# Altium project STM32RF.PrjPcb
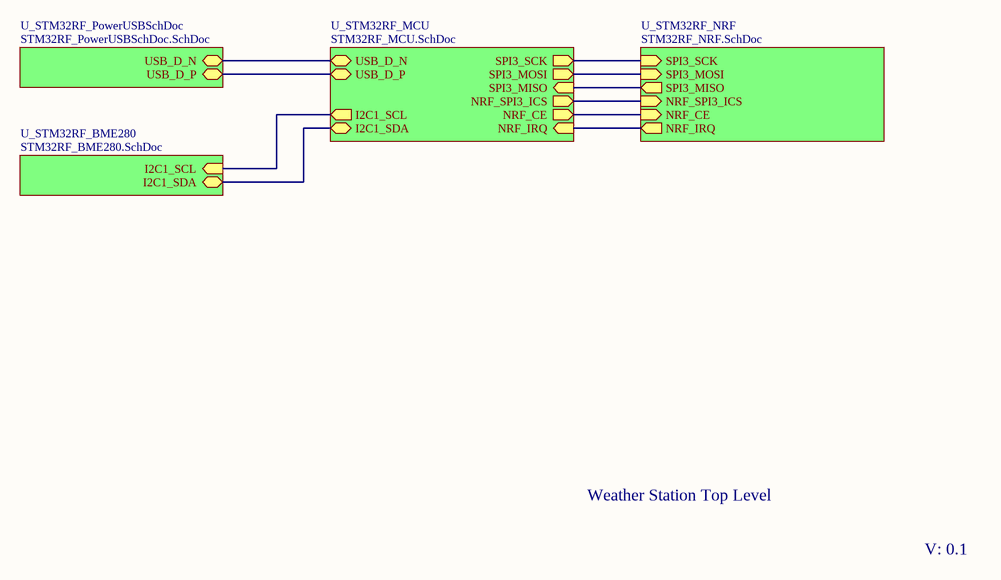
[diagram p0: STM32RF_TopLevel.SchDoc]
5 sheets, 72 parts. Net scope: hierarchical (ports join the sheet entries above them; power ports are global).
Board file: STM32RF_PCB.PcbDoc
Sheets:
  STM32RF_TopLevel.SchDoc
    U_STM32RF_MCU = STM32RF_MCU.SchDoc
    U_STM32RF_NRF = STM32RF_NRF.SchDoc
    U_STM32RF_BME280 = STM32RF_BME280.SchDoc
    U_STM32RF_PowerUSBSchDoc = STM32RF_PowerUSBSchDoc.SchDoc

## Sheet STM32RF_TopLevel.SchDoc
size A; SheetNumber: 1; SheetTotal: 5

### Sub-sheets
U_STM32RF_BME280 = STM32RF_BME280.SchDoc: I2C1_SCL (in), I2C1_SDA (bidir)
U_STM32RF_MCU = STM32RF_MCU.SchDoc: I2C1_SCL (out), I2C1_SDA (bidir), USB_D_N (bidir), USB_D_P (bidir), NRF_IRQ (in), SPI3_SCK (out), SPI3_MISO (in), SPI3_MOSI (out), NRF_SPI3_ICS (out), NRF_CE (out)
U_STM32RF_NRF = STM32RF_NRF.SchDoc: NRF_CE (in), NRF_SPI3_ICS (in), SPI3_MISO (out), SPI3_MOSI (in), SPI3_SCK (in), NRF_IRQ (out)
U_STM32RF_PowerUSBSchDoc = STM32RF_PowerUSBSchDoc.SchDoc: USB_D_N (bidir), USB_D_P (bidir)

### Nets
I2C1_SCL: sheet U_STM32RF_MCU/I2C1_SCL, sheet U_STM32RF_BME280/I2C1_SCL
I2C1_SDA: sheet U_STM32RF_MCU/I2C1_SDA, sheet U_STM32RF_BME280/I2C1_SDA
NRF_CE: sheet U_STM32RF_MCU/NRF_CE, sheet U_STM32RF_NRF/NRF_CE
NRF_IRQ: sheet U_STM32RF_MCU/NRF_IRQ, sheet U_STM32RF_NRF/NRF_IRQ
NRF_SPI3_ICS: sheet U_STM32RF_MCU/NRF_SPI3_ICS, sheet U_STM32RF_NRF/NRF_SPI3_ICS
SPI3_MISO: sheet U_STM32RF_MCU/SPI3_MISO, sheet U_STM32RF_NRF/SPI3_MISO
SPI3_MOSI: sheet U_STM32RF_MCU/SPI3_MOSI, sheet U_STM32RF_NRF/SPI3_MOSI
SPI3_SCK: sheet U_STM32RF_MCU/SPI3_SCK, sheet U_STM32RF_NRF/SPI3_SCK
USB_D_N: sheet U_STM32RF_MCU/USB_D_N, sheet U_STM32RF_PowerUSBSchDoc/USB_D_N
USB_D_P: sheet U_STM32RF_MCU/USB_D_P, sheet U_STM32RF_PowerUSBSchDoc/USB_D_P

### Notes on the sheet
- Weather Station Top Level
- V: 0.1

## Sheet STM32RF_MCU.SchDoc
size A4; SheetNumber: 2; SheetTotal: 5
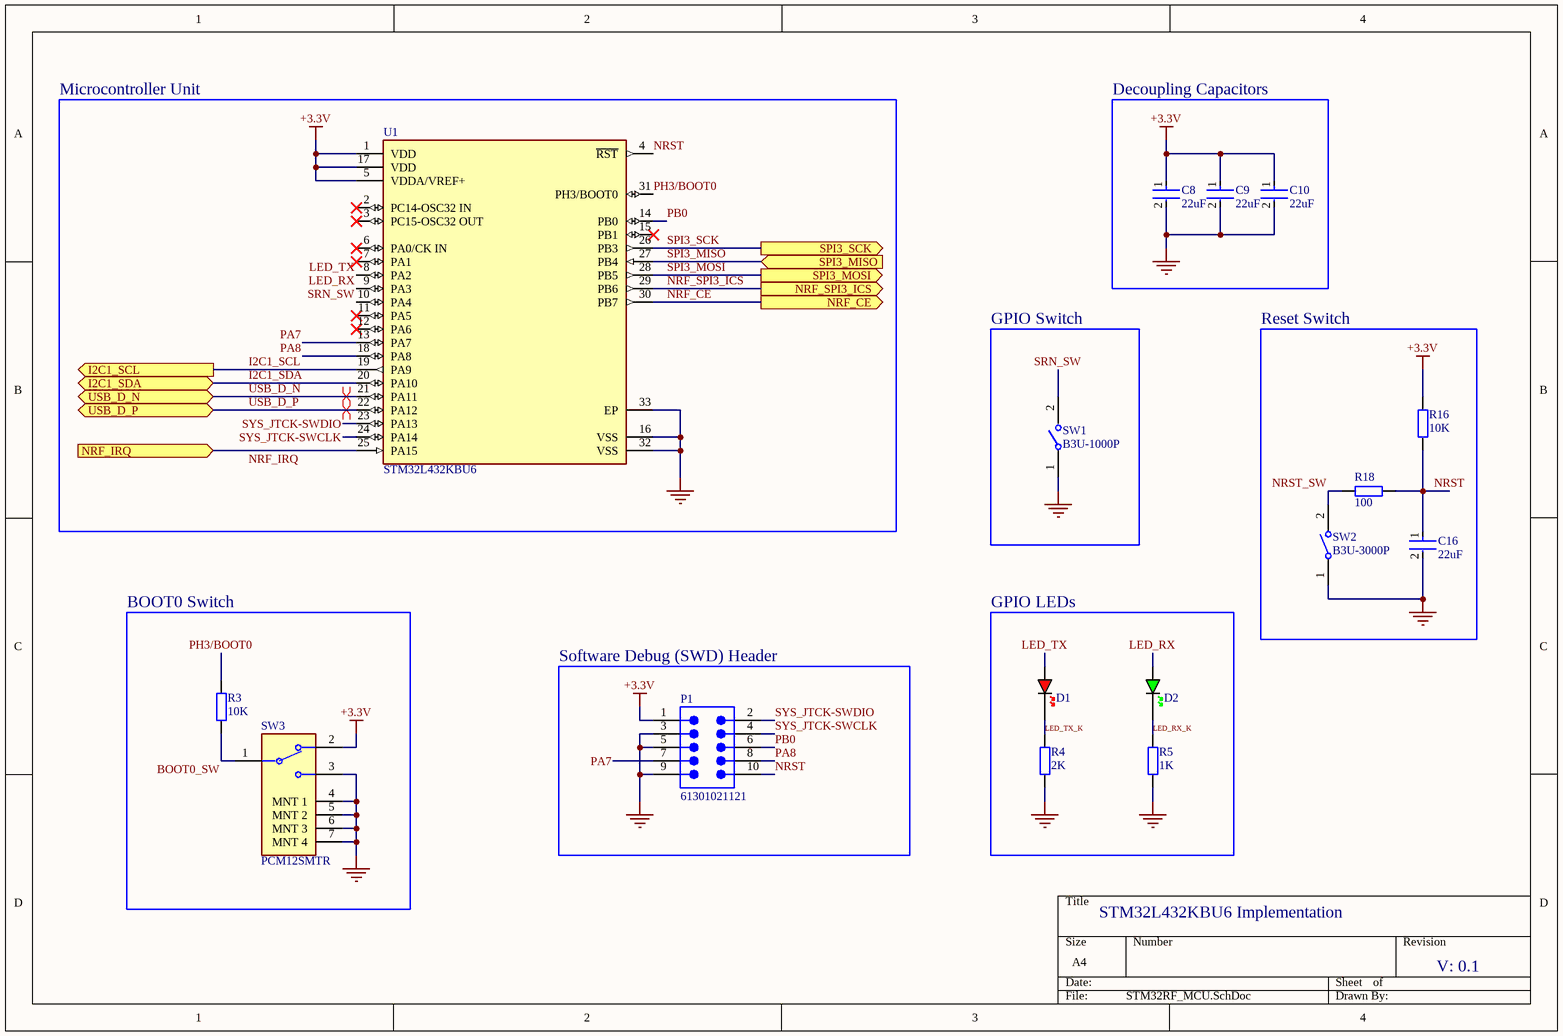
[diagram p1: STM32RF_MCU.SchDoc]

### Parts
C8  22uF  [FP-GRM158-0_2-MFG]
C9  22uF  [FP-GRM158-0_2-MFG]
C10  22uF  [FP-GRM158-0_2-MFG]
C16  22uF  [FP-GRM158-0_2-MFG]
D1  RED  [LED_0402_RED]  (value not drawn)
D2  GREEN  [LED_0402_GREEN]  (value not drawn)
P1  61301021121  [61301021121]
R3  10K  [RES_0402]
R4  2K  [RES_0402]
R5  1K  [RES_0402]
R16  10K  [RES_0402]
R18  100  [RES_0402]
SW1  B3U-1000P  [FP-B3U-1000P-MFG]
SW2  B3U-3000P  [OMRON-B3U-3000P_V]
SW3  PCM12SMTR  [FP-PCM12SMTR-MFG]
U1  STM32L432KBU6  [FP-UFQFPN32-A0B8-MFG]

### Blocks framed on the sheet
Microcontroller Unit: U1
Decoupling Capacitors: C8-C10
GPIO Switch: SW1
Reset Switch: C16 R16 R18 SW2
BOOT0 Switch: R3 SW3
GPIO LEDs: D1 D2 R4 R5
Software Debug (SWD) Header: P1

### Ports
I2C1_SCL (out, see STM32RF_TopLevel[2C], STM32RF_BME280[2C]), I2C1_SDA (bidir, see STM32RF_TopLevel[2C], STM32RF_BME280[2C]), NRF_CE (out, see STM32RF_TopLevel[3C], STM32RF_NRF[1A]), NRF_IRQ (in, see STM32RF_TopLevel[3C], STM32RF_NRF[2A]), NRF_SPI3_ICS (out, see STM32RF_TopLevel[3B], STM32RF_NRF[1A]), SPI3_MISO (in, see STM32RF_TopLevel[3B], STM32RF_NRF[1A]), SPI3_MOSI (out, see STM32RF_TopLevel[3B], STM32RF_NRF[1A]), SPI3_SCK (out, see STM32RF_TopLevel[3B], STM32RF_NRF[1A]), USB_D_N (bidir, see STM32RF_TopLevel[2B], STM32RF_PowerUSBSchDoc[2A]), USB_D_P (bidir, see STM32RF_TopLevel[2B], STM32RF_PowerUSBSchDoc[2A])

### Nets
+3.3V: C8.1 C9.1 C10.1 P1.1 R16.2 SW3.2 U1.1(VDD) U1.5(VDDA/VREF+) U1.17(VDD)
GND: C8.2 C9.2 C10.2 C16.2 P1.3 P1.5 P1.9 R4.1 R5.1 SW1.1 SW2.1 SW3.3 SW3.4(MNT_1) SW3.5(MNT_2) SW3.6(MNT_3) SW3.7(MNT_4) U1.16(VSS) U1.32(VSS) U1.33(EP)
BOOT0_SW: R3.1 SW3.1
I2C1_SCL: U1.19(PA9) ; port I2C1_SCL
I2C1_SDA: U1.20(PA10) ; port I2C1_SDA
LED_RX: D2.A U1.9(PA3)
LED_RX_K: D2.K R5.2
LED_TX: D1.A U1.8(PA2)
LED_TX_K: D1.K R4.2
NRF_CE: U1.30(PB7) ; port NRF_CE
NRF_IRQ: U1.25(PA15) ; port NRF_IRQ
NRF_SPI3_ICS: U1.29(PB6) ; port NRF_SPI3_ICS
NRST: C16.1 P1.10 R16.1 R18.1 U1.4(~{RST})
NRST_SW: R18.2 SW2.2
PA7: P1.7 U1.13(PA7)
PA8: P1.8 U1.18(PA8)
PB0: P1.6 U1.14(PB0)
PH3/BOOT0: R3.2 U1.31(PH3/BOOT0)
SPI3_MISO: U1.27(PB4) ; port SPI3_MISO
SPI3_MOSI: U1.28(PB5) ; port SPI3_MOSI
SPI3_SCK: U1.26(PB3) ; port SPI3_SCK
SRN_SW: SW1.2 U1.10(PA4)
SYS_JTCK-SWCLK: P1.4 U1.24(PA14)
SYS_JTCK-SWDIO: P1.2 U1.23(PA13)
USB_D_N: U1.21(PA11) ; port USB_D_N
USB_D_P: U1.22(PA12) ; port USB_D_P

Not connected (* = marked no-connect by the designer): U1 2(PC14-OSC32_IN)* 3(PC15-OSC32_OUT)* 6(PA0/CK_IN)* 7(PA1)* 11(PA5)* 12(PA6)* 15(PB1)*

### Layout directives
differential pair: USB_D_N, USB_D_P

### Notes on the sheet
- STM32L432KBU6 Implementation
- V: 0.1

### Library data of the parts
C8-C10 C16 = CMP-06035-020400-1: Chip Multilayer Ceramic Capacitors for General Purpose, 0402, 22uF, X5R, 15%, 20%, 10V
D1 = LED_0402_RED: LED 0402 RED SMD
D2 = LED_0402_GREEN: LED 0402 GREEN SMD
P1 = CMP-1502-01084-4: THT Vertical Pin Header WR-PHD, Pitch 2.54 mm, Dual Row, 10 pins; Insulation Resistance: 1GΩ; Connector Type: Male Pin; Number of Contacts: 10; Pitch: 2.54mm; Contact Resistance: 20mΩ; Current Rating: 3A; Gender: Male; Insulation: Insulated; Voltage Rating: 250V; Mount: Through Hole; Orientation: Vertical; Max Operating Temperature: 105°C; Height: 8.89mm; Number of Pins: 10; Housing Material: PBT; Number of Positions: 10; Packaging: Bulk; RoHS: Compliant; Contact Mating Length: 5.9944mm; Lead Pitch: 2.54mm; Contact Gender: Male; Flammability Rating: UL94 V-0; Color: Black; Termination: Through Hole; Width: 12.7mm; Number of Rows: 2; Contact Material: Gold; Contact Plating: Gold; Operating Supply Voltage: 250V; Length: 12.7mm; Min Operating Temperature: -40°C; Row Spacing: 2.54mm
R3-R5 R16 R18 = RES_0402: Resistor SMD 0402; Manufacturer: *; Manufacturer Part Number: *; Distributor Link: *; LCSC: *
SW1 = CMP-2100-03586-2: SWITCH TACTILE SPST-NO 0.05A 12V; Contact Resistance: 100mR; Operating Force: 1.5N; Max Current Rating: 50mA; Switch Travel: 0.15mm; Actuator Type: Standard; Mechanical Life: 200000Cycles; Ratings: Dust Proof; Illumination Type: Non-Illuminated; Throw Configuration: SPST; Actuator Length: 0.4mm; Switch Function: Off-Mom; Height: 1.2mm; Width: 3mm; Weight: 0.000776oz; Contact Material: Silver; Max Voltage Rating (DC): 12V; Insulation Resistance: 100MR; Lead Free: Lead Free; Current Rating: 50mA; Termination: SMD/SMT; Length: 4mm; Voltage Rating (DC): 12V; Contact Current Rating: 50mA; Orientation: Straight; Depth: 2.5mm; Max Operating Temperature: 70°C; Packaging: Tape and Reel; Min Operating Temperature: -25°C; Package Quantity: 1; Mount: Surface Mount; Electrical Life: 200000Cycles
SW2 = CMP-1677-00003-1: Ultra-Small Tactile Switch, 1 to 50 mA, 3 to 12 V, -25 to 70 degC, 2-Pin SMD, RoHS, Tape and Reel; Tolerance: 20%; Voltage Rating (DC): 50 V; Capacitance: 470 uF; Case\Package: Radial; PackageReference: B3U-3000P; Min Operating Temperature: -40 degC; Length: 20 mm; Mount: Through Hole; ComponentLink2Description: Datasheet; RoHSCompliant: true; ComponentLink1URL: http://www.omron.com/; Package Quantity: 200; Radiation Hardening: No; Height: 20 mm; ComponentLink2URL: https://www.omron.com/ecb/products/pdf/en-b3u.pdf; Diameter: 10 mm; Max Operating Temperature: 85 degC; Lead Pitch: 5 mm; DatasheetVersion: Jan-15; Packaging: Bulk; PackageDescription: 2-Pin Surface Mount Device, Body 4 x 3.2 mm; Voltage Rating: 50 V; Pins: 2; ComponentLink1Description: Manufacturer URL; REACH SVHC: No SVHC
SW3 = CMP-2000-06884-2: SWITCH SLIDE SPDT 300MA 6V; Actuator Material: Nylon; Switch Function: On-On; Insulation Resistance: 100mR; Actuator Type: Standard; Mechanical Life: 10000Cycles; Actuator Length: 1.5mm; Contact Resistance: 70mR; Min Operating Temperature: -20°C; Max Current Rating: 300mA; Max Voltage Rating (DC): 6V; Package Quantity: 1; Mount: Surface Mount; Packaging: Tape and Reel; Contact Plating: Silver; Depth: 5mm; REACH SVHC: No SVHC; Voltage Rating (DC): 6V; Voltage Rating (AC): 6V; Max Operating Temperature: 85°C; Length: 7.7mm; Termination: Gull Wing; Current Rating: 300mA; Contact Current Rating: 300mA; Orientation: Right Angle; Width: 6.7mm; Switch Travel: 1.5mm; Lead Free: Lead Free; Contact Material: Copper Alloy; Throw Configuration: SPDT
U1 = CMP-12105-000014-1: IC MCU 32BIT 128KB FLASH 32QFPN; Manufacturer: STMicroelectronics; Memory Size: 128KBytes; Number Of I/Os: 26; Max Supply Voltage: 3.6V; Core Architecture: ARM Cortex-M4; Number Of A/D Converters: 1; Number Of Timers/Counters: 8; Min Supply Voltage: 1.62V; Interface: I2C,SPI,UART,USART,USB,IrDA; Number Of Spi Channels: 2; Frequency: 80MHz; Max Junction Temp: +105°C; Number Of Adc Channels: 10; Ram Size: 64KBytes; Data Bus Width: 32bits; Ambient Temperature Range High: +85°C; Device Class L2: Embedded Processors and Controllers; Temperature: -40°C to +85°C; Category: IC; ComponentLink2URL: https://www.st.com/resource/en/datasheet/stm32l432kb.pdf; Device Class L1: Integrated Circuits (ICs); ComponentLink2Description: Datasheet; Memory Type: FLASH; Ipc Land Pattern Name: QFN50P500X500X55-32; Temperature Range Low: -40°C; Height: 0.6mm; Digikey Description: IC MCU 32BIT 128KB FLASH 32QFPN; Temperature Range High: +85°C; Device Class L3: Microcontrollers; Lead Free: Yes; RoHS: TRUE; Octopart: https://octopart.com/stm32l432kbu6-stmicroelectronics-74568735; Manufacturer Part Number: STM32L432KBU6; Number Of Uart Channels: 1; Ambient Temperature Range Low: -40°C; Package: UFQFPN32-A0B8; Number Of I2C Channels: 2; Number Of Cores: 1; Automotive: No

## Sheet STM32RF_NRF.SchDoc
size A4; SheetNumber: 4; SheetTotal: 5
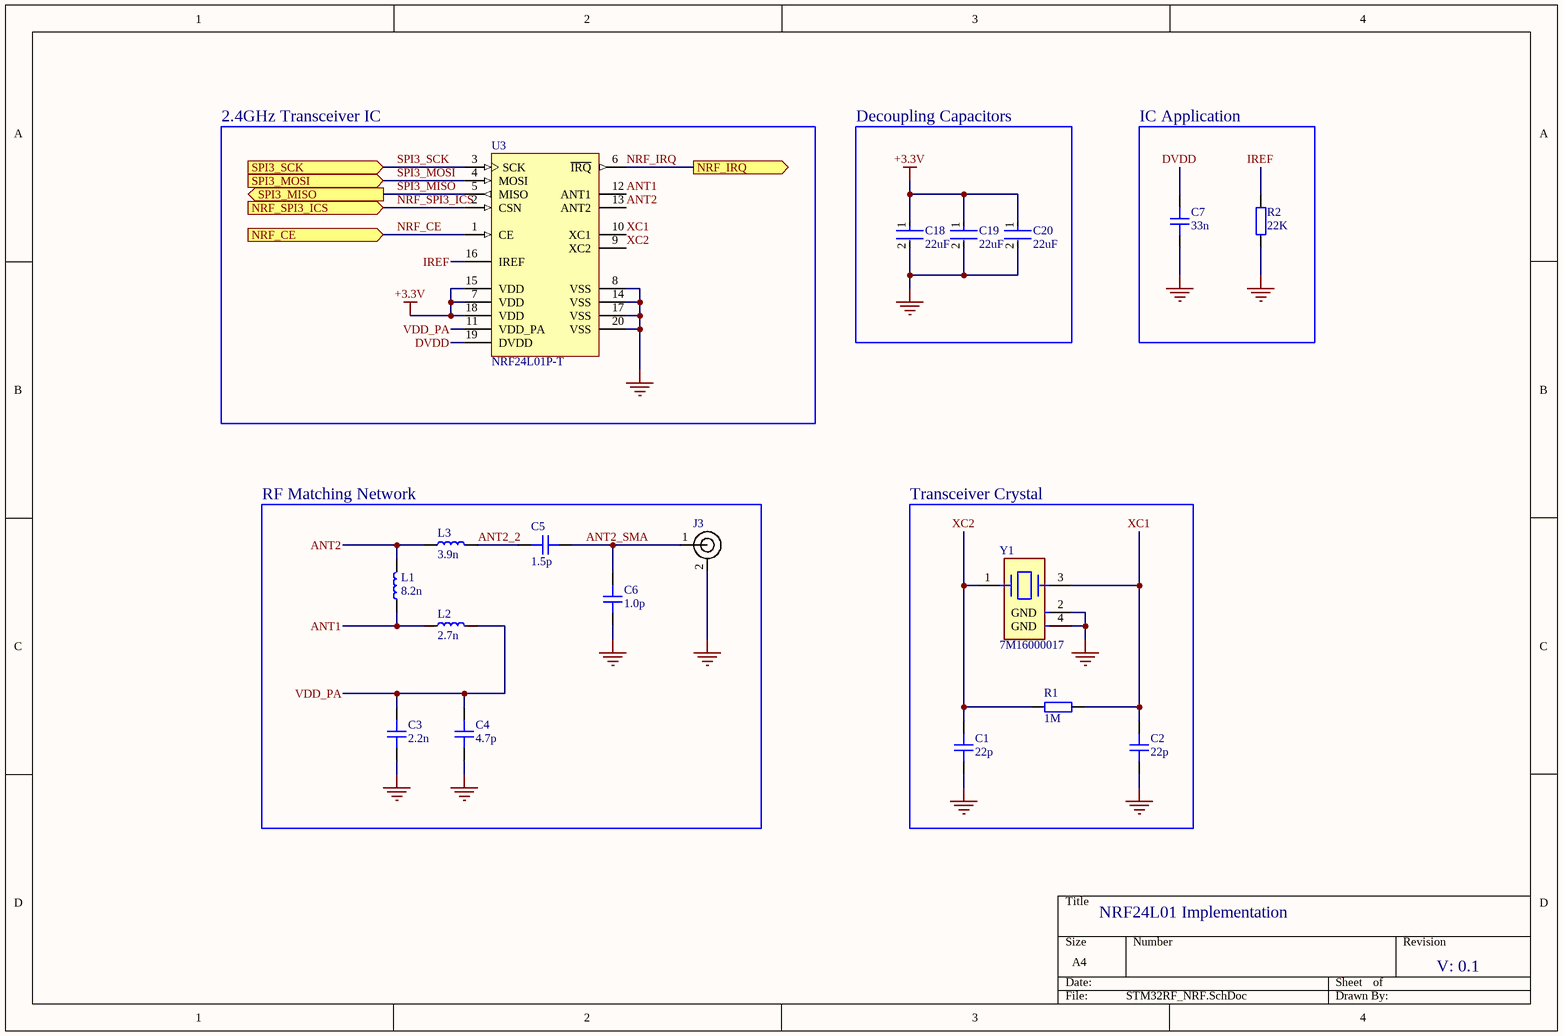
[diagram p2: STM32RF_NRF.SchDoc]

### Parts
C1  22p  [CAP_0402]
C2  22p  [CAP_0402]
C3  2.2n  [CAP_0402]
C4  4.7p  [CAP_0402]
C5  1.5p  [CAP_0402]
C6  1.0p  [CAP_0402]
C7  33n  [CAP_0402]
C18  22uF  [FP-GRM158-0_2-MFG]
C19  22uF  [FP-GRM158-0_2-MFG]
C20  22uF  [FP-GRM158-0_2-MFG]
J3  CON-SMA-EDGE-S  [CON-SMA-EDGE-S]  (value not drawn)
L1  8.2n  [IND_0402]
L2  2.7n  [IND_0402]
L3  3.9n  [IND_0402]
R1  1M  [RES_0402]
R2  22K  [RES_0402]
U3  NRF24L01P-T  [NRSC-QFN-20_L]
Y1  7M16000017  [FP-7M-MFG]

### Blocks framed on the sheet
2.4GHz Transceiver IC: U3
Decoupling Capacitors: C18-C20
IC Application: C7 R2
RF Matching Network: C3-C6 J3 L1-L3
Transceiver Crystal: C1 C2 R1 Y1

### Ports
NRF_CE (in, see STM32RF_TopLevel[3C], STM32RF_MCU[2B]), NRF_IRQ (out, see STM32RF_TopLevel[3C], STM32RF_MCU[1B]), NRF_SPI3_ICS (in, see STM32RF_TopLevel[3B], STM32RF_MCU[2B]), SPI3_MISO (out, see STM32RF_TopLevel[3B], STM32RF_MCU[2B]), SPI3_MOSI (in, see STM32RF_TopLevel[3B], STM32RF_MCU[2B]), SPI3_SCK (in, see STM32RF_TopLevel[3B], STM32RF_MCU[2A])

### Nets
+3.3V: C18.1 C19.1 C20.1 U3.7(VDD) U3.15(VDD) U3.18(VDD)
GND: C1.1 C2.1 C3.1 C4.1 C6.1 C7.1 C18.2 C19.2 C20.2 J3.2 R2.1 U3.8(VSS) U3.14(VSS) U3.17(VSS) U3.20(VSS) Y1.2(GND) Y1.4(GND)
ANT1: L1.1 L2.1 U3.12(ANT1)
ANT2: L1.2 L3.1 U3.13(ANT2)
ANT2_2: C5.2 L3.2
ANT2_SMA: C5.1 C6.2 J3.1
DVDD: C7.2 U3.19(DVDD)
IREF: R2.2 U3.16(IREF)
NRF_CE: U3.1(CE) ; port NRF_CE
NRF_IRQ: U3.6(~{IRQ}) ; port NRF_IRQ
NRF_SPI3_ICS: U3.2(CSN) ; port NRF_SPI3_ICS
SPI3_MISO: U3.5(MISO) ; port SPI3_MISO
SPI3_MOSI: U3.4(MOSI) ; port SPI3_MOSI
SPI3_SCK: U3.3(SCK) ; port SPI3_SCK
VDD_PA: C3.2 C4.2 L2.2 U3.11(VDD_PA)
XC1: C2.2 R1.2 U3.10(XC1) Y1.3
XC2: C1.2 R1.1 U3.9(XC2) Y1.1

### Notes on the sheet
- NRF24L01 Implementation
- V: 0.1

### Library data of the parts
C1-C7 = CAP_0402: Capacitor SMD 0402; Manufacturer: *; Manufacturer Part Number: *; Distributor Link: *; LCSC: *; Rating: *; Dielectric: *
C18-C20 = CMP-06035-020400-1: as C8 on sheet STM32RF_MCU
J3 = CON-SMA-EDGE-S: RF Connector SMA Female 50 Ohms 18 GHz PCB Edge Mount; Manufacturer: RF Solutions; Manufacturer Part Number: CON-SMA-EDGE-S
L1-L3 = IND_0402: Inductor SMD 0402
R1 R2 = RES_0402: Resistor SMD 0402; Manufacturer: *; Manufacturer Part Number: *; Distributor Link: *; LCSC: *
U3 = CMP-2000-06859-1: Single Chip Transceiver, 2.4 GHz, 60 mW, 1.9 to 3.6 V, -40 to 85 degC, 20-Pin QFN, RoHS, Tray; Manufacturer: Nordic Semiconductor; Data Rate (Max): 2Mbps; Current - Transmitting: 7mA~11.3mA; Power - Output: 0dBm; Other Names: 1490-1019; Online Catalog: nRF24L01+; Current - Receiving: 12.6mA~13.5mA; For Use With: 1490-1002-ND-KITEVALUATIONNRF24L01P1568-1295-ND-SPARKFUNTRANSCEIVERBREAKOUT-1568-1296-ND-SPARKFUNTRANSCEIVERBREAKOUT-1471-1410-ND-DEVBOARDNRFSCLICKNRF24L01P-MODULE-PCB-ND-KITEVALNRF24L01+PCBANTENNANRF24L01P-MODULE-SMA-ND-KITEVALNRF24L01+SMACONNNRF24L01P-UPGRADE-ND-UPGRADE2PCB/1SMANRF24L01103990038-ND-DEVDUINOSENSORNODEV1.3103990053-ND-DEVDUINOSENSORNODEV2(ATMEGA103990074-ND-DEVDUINOSENSORNODE106990026-ND-ENERGYMONITORSHIELDV2113990088-ND-WIRELESSGATESHIELD113990095-ND-DEVDUINOSENSORNODEV3(ATMEGA106030001-ND-ENERGYMONITORSHIELD1597-1361-ND-DEVDUINOSENSORNODEV2.2(ATMEG105990030-ND-RGBWSTRIPWIRELESSSHIELDV1.0; Frequency: 2.4GHz; Design Resources: DevelopmentToolSelector; RF Family/Standard: GeneralISM>1GHZ; Serial Interfaces: SPI; Sensitivity: -94dBm; Voltage - Supply: 1.9V~3.6V; Modulation: GFSK; GPIO: -; Package Reference: QFN20; Memory Size: -; Category: RF/IFandRFID; Type: TxRxOnly; Standard Package: 490; Package / Case: 20-VFQFNExposedPad; Packaging: Tray; Series: -; Package Description: 20-Pin Quad Flat No-lead Package, Body 4 x 4 mm, Pitch 0.5 mm; Datasheet Version: Rev. 1.0, 09/2008; Protocol: -; Manufacturer URL: http://www.nordicsemi.com/eng/Products/; Operating Temperature: -40°C~85°C; Family: RFTransceiverICs; Datasheet URL: http://www.nordicsemi.com/eng/content/download/2726/34069/file/nRF24L01P_Product_Specification_1_0.pdf; Mounting Technology: SurfaceMount
Y1 = CMP-18717-000287-1: Crystal 16MHz, 10ppm, 9pF, 60Ω; ESR (Equivalent Series Resistance): 50R; Packaging: Tape and Reel; Frequency: 16MHz; Min Operating Temperature: -20°C; Length: 0.126inch; Height: 0.031inch; Frequency Stability: 10ppm; Frequency Tolerance: 10ppm; Max Operating Temperature: 75°C; Case/Package: SMD/SMT; Load Capacitance: 9pF; Mount: Surface Mount; Width: 0.098inch

## Sheet STM32RF_BME280.SchDoc
size A4; SheetNumber: 5; SheetTotal: 5
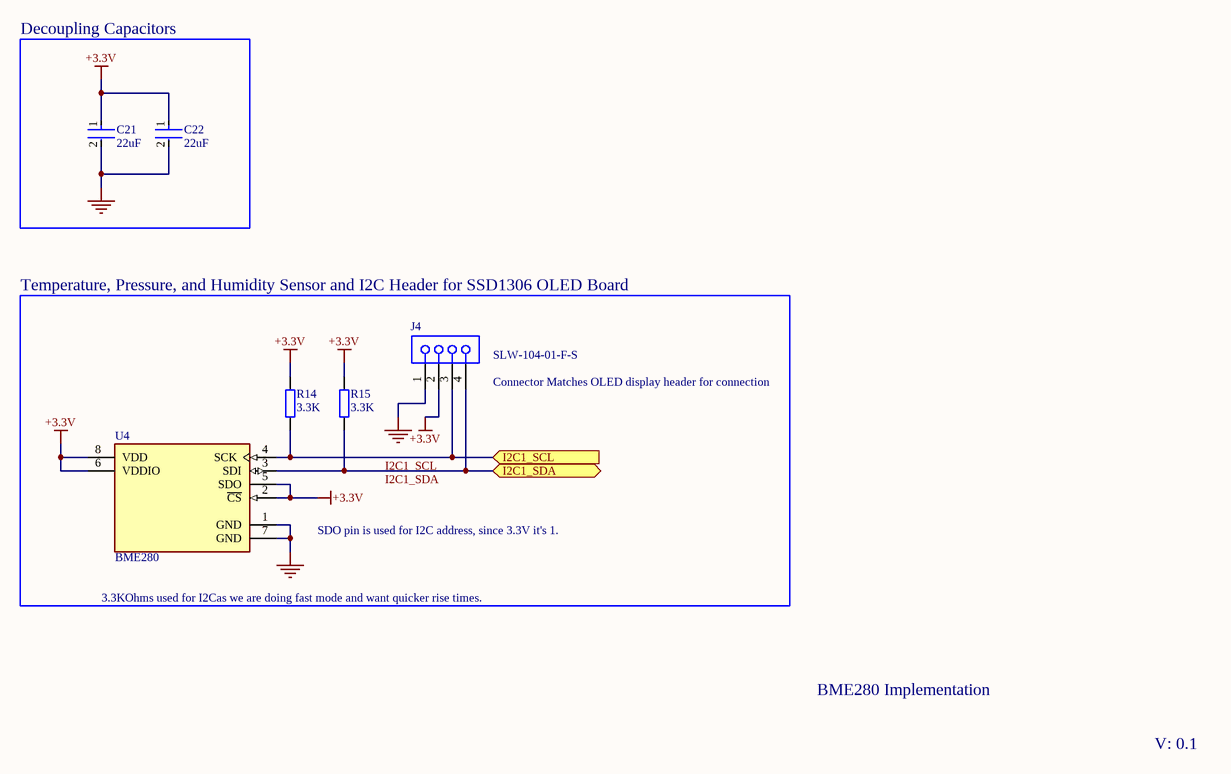
[diagram p3: STM32RF_BME280.SchDoc]

### Parts
C21  22uF  [FP-GRM158-0_2-MFG]
C22  22uF  [FP-GRM158-0_2-MFG]
J4  SLW-104-01-F-S  [SMTC-SLW-104-01-X-S]
R14  3.3K  [RES_0402]
R15  3.3K  [RES_0402]
U4  BME280  [FP-BME280-MFG]

### Blocks framed on the sheet
Decoupling Capacitors: C21 C22

### Ports
I2C1_SCL (in, see STM32RF_TopLevel[2C], STM32RF_MCU[1B]), I2C1_SDA (bidir, see STM32RF_TopLevel[2C], STM32RF_MCU[1B])

### Nets
+3.3V: C21.1 C22.1 J4.2 R14.2 R15.2 U4.2(~{CS}) U4.5(SDO) U4.6(VDDIO) U4.8(VDD)
GND: C21.2 C22.2 J4.1 U4.1(GND) U4.7(GND)
I2C1_SCL: J4.3 R14.1 U4.4(SCK) ; port I2C1_SCL
I2C1_SDA: J4.4 R15.1 U4.3(SDI) ; port I2C1_SDA

### Notes on the sheet
- Temperature, Pressure, and Humidity Sensor and I2C Header for SSD1306 OLED Board
- (near J4) Connector Matches OLED display header for connection
- SDO pin is used for I2C address, since 3.3V it's 1.
- 3.3KOhms used for I2Cas we are doing fast mode and want quicker rise times.
- BME280 Implementation
- V: 0.1

### Library data of the parts
C21 C22 = CMP-06035-020400-1: as C8 on sheet STM32RF_MCU
J4 = CMP-1023-00132-1: Low Profile Socket Strips, Through-hole, Vertical, -55 to 125 degC, 2.54 mm Pitch, 4-Pin, Female, RoHS; Manufacturer: Samtec; Pitch: 2.54 mm; PackageVersion: X, 9/1987; ComponentLink2Description: Datasheet; PackageDescription: Low Profile Socket Strip; ComponentLink1URL: http://www.samtec.com; Orientation: Vertical; ComponentLink3URL: http://www.samtec.com/documents/webfiles/cpdf/SLW-1XX-01-X-X-MKT.pdf; ComponentLink1Description: Manufacturer URL; ComponentLink2URL: http://www.samtec.com/documents/webfiles/pdf/SLW.PDF; PackageReference: SLW-104-01-X-S; Mounting Technology: Through-hole; PartNumber: SLW-104-01-F-S; Temperature Range: -55 to 125 degC; DatasheetVersion: F-214; ComponentLink3Description: Package Specification; RoHS: True
R14 R15 = RES_0402: Resistor SMD 0402; Manufacturer: *; Manufacturer Part Number: *; Distributor Link: *; LCSC: *
U4 = CMP-2000-05073-3: SENSOR PRESSURE HUMIDITY TEMP; Sensor Type: Temperature; Accuracy: 3%; Response Time: 1s; Output Type: SPI; Min Operating Temperature: -40°C; Max Operating Temperature: 85°C; Case/Package: LGA; Packaging: Cut Tape; Mount: Surface Mount; Lead Free: Lead Free; Number of Pins: 8

## Sheet STM32RF_PowerUSBSchDoc.SchDoc
size A4; SheetNumber: 3; SheetTotal: 5
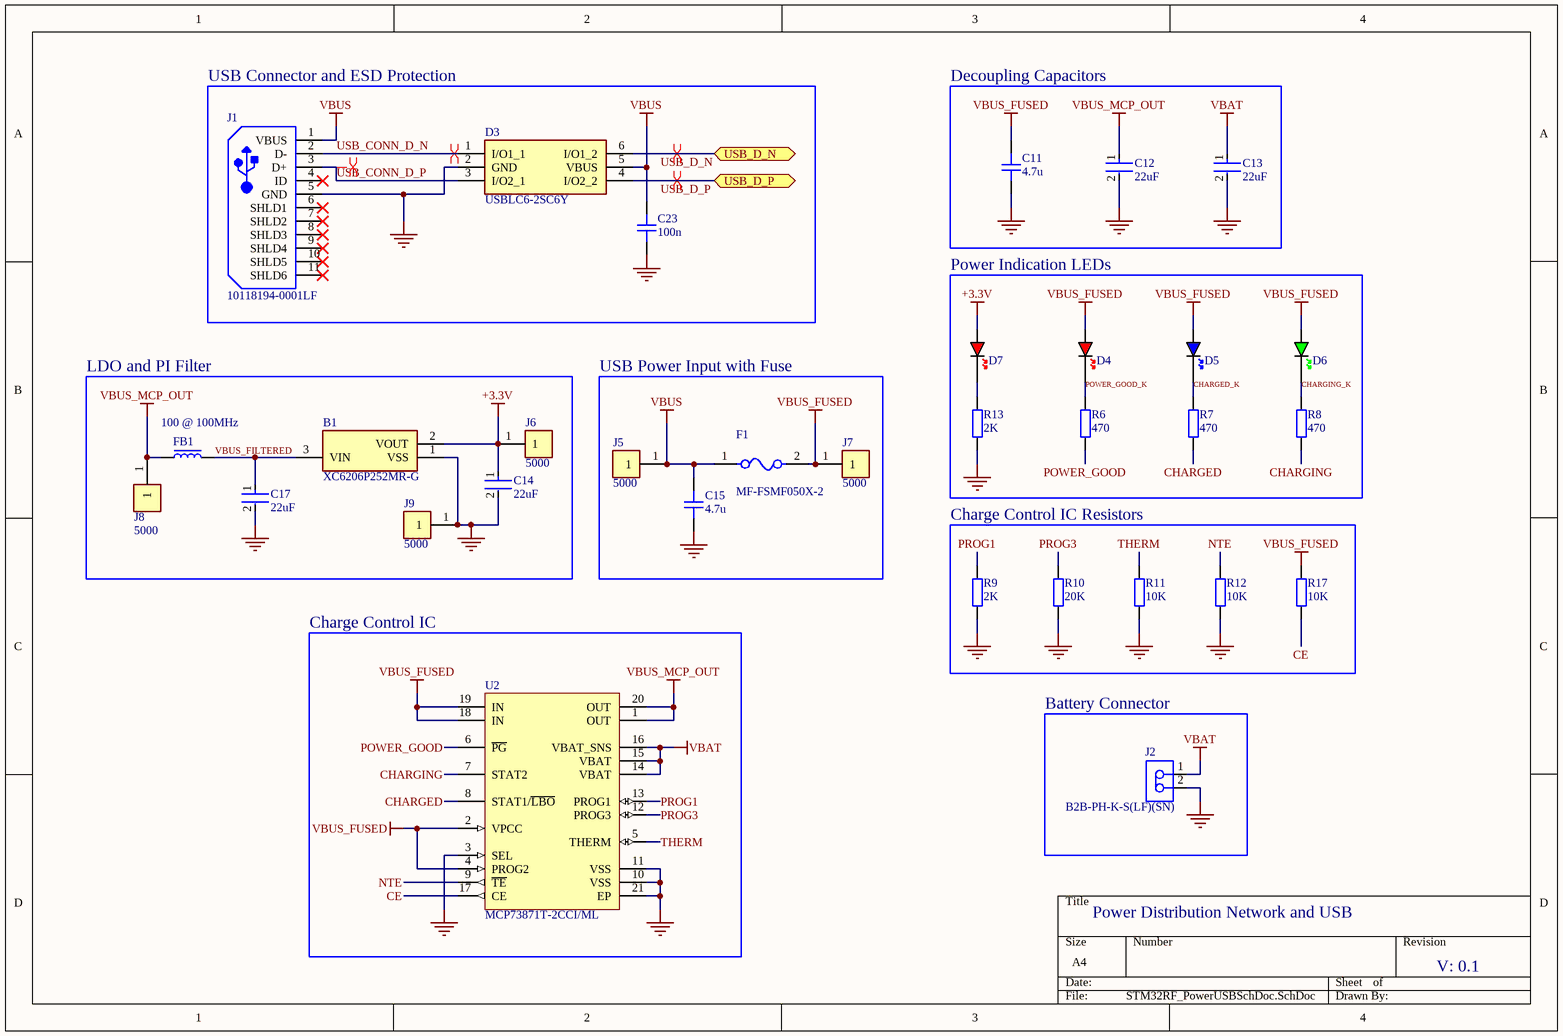
[diagram p4: STM32RF_PowerUSBSchDoc.SchDoc]

### Parts
B1  XC6206P252MR-G  [SOT95P280X130-3N]
C11  4.7u  [CAP_0402]
C12  22uF  [FP-GRM158-0_2-MFG]
C13  22uF  [FP-GRM158-0_2-MFG]
C14  22uF  [FP-GRM158-0_2-MFG]
C15  4.7u  [CAP_0402]
C17  22uF  [FP-GRM158-0_2-MFG]
C23  100n  [CAP_0402]
D3  USBLC6-2SC6Y  [SOT95P280X145-6N]
D4  RED  [LED_0402_RED]  (value not drawn)
D5  BLUE  [LED_0402_BLUE]  (value not drawn)
D6  GREEN  [LED_0402_GREEN]  (value not drawn)
D7  RED  [LED_0402_RED]  (value not drawn)
F1  MF-FSMF050X-2  [FP-MF-FSMF-MFG]
FB1  100 @ 100MHz  [FB_0603]
J1  10118194-0001LF  [FCI-10118194-0001LF-5_V]
J2  B2B-PH-K-S(LF)(SN)  [JST-B2B-PH-K-S_V]
J5  5000  [FP-5000-MFG]
J6  5000  [FP-5000-MFG]
J7  5000  [FP-5000-MFG]
J8  5000  [FP-5000-MFG]
J9  5000  [FP-5000-MFG]
R6  470  [RES_0402]
R7  470  [RES_0402]
R8  470  [RES_0402]
R9  2K  [RES_0402]
R10  20K  [RES_0402]
R11  10K  [RES_0402]
R12  10K  [RES_0402]
R13  2K  [RES_0402]
R17  10K  [RES_0402]
U2  MCP73871T-2CCI/ML  [QFN-ML20_L]

### Blocks framed on the sheet
USB Connector and ESD Protection: C23 D3 J1
Decoupling Capacitors: C11-C13
Power Indication LEDs: D4-D7 R6-R8 R13
LDO and PI Filter: B1 C14 C17 FB1 J6 J8 J9
USB Power Input with Fuse: C15 F1 J5 J7
Charge Control IC Resistors: R9-R12 R17
Charge Control IC: U2
Battery Connector: J2

### Ports
USB_D_N (bidir, see STM32RF_TopLevel[2B], STM32RF_MCU[1B]), USB_D_P (bidir, see STM32RF_TopLevel[2B], STM32RF_MCU[1B])

### Nets
+3.3V: B1.2(VOUT) C14.1 D7.A J6.1
GND: B1.1(VSS) C11.1 C12.2 C13.2 C14.2 C15.1 C17.2 C23.1 D3.2(GND) J1.5(GND) J2.2 J9.1 R9.1 R10.1 R11.1 R12.1 R13.1 U2.3(SEL) U2.10(VSS) U2.11(VSS) U2.21(EP)
VBAT: C13.1 J2.1 U2.14(VBAT) U2.15(VBAT) U2.16(VBAT_SNS)
VBUS: C15.2 C23.2 D3.5(VBUS) F1.1 J1.1(VBUS) J5.1
VBUS_FUSED: C11.2 D4.A D5.A D6.A F1.2 J7.1 R17.2 U2.2(VPCC) U2.4(PROG2) U2.18(IN) U2.19(IN)
VBUS_MCP_OUT: C12.1 FB1.1 J8.1 U2.1(OUT) U2.20(OUT)
CE: R17.1 U2.17(CE)
CHARGED: R7.1 U2.8(STAT1/~{LBO})
CHARGED_K: D5.K R7.2
CHARGING: R8.1 U2.7(STAT2)
CHARGING_K: D6.K R8.2
NTE: R12.2 U2.9(~{TE})
POWER_GOOD: R6.1 U2.6(~{PG})
POWER_GOOD_K: D4.K R6.2
PROG1: R9.2 U2.13(PROG1)
PROG3: R10.2 U2.12(PROG3)
THERM: R11.2 U2.5(THERM)
USB_CONN_D_N: D3.1(I/O1_1) J1.2(D-)
USB_CONN_D_P: D3.3(I/O2_1) J1.3(D+)
USB_D_N: D3.6(I/O1_2) ; port USB_D_N
USB_D_P: D3.4(I/O2_2) ; port USB_D_P
VBUS_FILTERED: B1.3(VIN) C17.1 FB1.2
NetD7_K: D7.K R13.2

Not connected (* = marked no-connect by the designer): J1 4(ID)* 6(SHLD1)* 7(SHLD2)* 8(SHLD3)* 9(SHLD4)* 10(SHLD5)* 11(SHLD6)*

### Layout directives
differential pair: USB_CONN_D_N, USB_CONN_D_P, USB_D_N, USB_D_P

### Notes on the sheet
- Power Distribution Network and USB
- V: 0.1

### Library data of the parts
B1 = XC6206P252MR-G: LDO Voltage Regulators 1uA Low Quiescent 3 Terminal, Low ESR Cap. Compatible, Voltage Regulator; Manufacturer_Name: Torex; Geometry.Height: 1.3mm; Manufacturer_Part_Number: XC6206P252MR-G; Mouser Part Number: 865-XC6206P252MR-G; Mouser Price/Stock: https://www.mouser.co.uk/ProductDetail/Torex-Semiconductor/XC6206P252MR-G?qs=AsjdqWjXhJ%2FThrLMef8qfg%3D%3D; Arrow Part Number: *; Arrow Price/Stock: *; Datasheet Link: https://www.torexsemi.com/file/xc6206/XC6206.pdf
C11 C15 C23 = CAP_0402: Capacitor SMD 0402; Manufacturer: Murata Electronics; Manufacturer Part Number: GRM155R61E475ME15D; Distributor Link: *; LCSC: *; Rating: *; Dielectric: *
C12-C14 C17 = CMP-06035-020400-1: as C8 on sheet STM32RF_MCU
D3 = USBLC6-2SC6Y: Low Cap. ESD Protection Auto SOT-23-6 STMicroelectronics USBLC6-2SC6Y, Dual Uni-Directional TVS Diode Array, 6-Pin SOT-23; Geometry.Height: 1.45mm; Manufacturer_Name: STMicroelectronics; Manufacturer_Part_Number: USBLC6-2SC6Y; Mouser Part Number: 511-USBLC6-2SC6Y; Mouser Price/Stock: https://www.mouser.co.uk/ProductDetail/STMicroelectronics/USBLC6-2SC6Y?qs=gNDSiZmRJS%2FOgDexvXkdow%3D%3D; Arrow Part Number: USBLC6-2SC6Y; Arrow Price/Stock: https://www.arrow.com/en/products/usblc6-2sc6y/stmicroelectronics?utm_currency=USD&region=nac; Datasheet Link: https://www.st.com/resource/en/datasheet/usblc6-2sc6y.pdf
D4 D7 = LED_0402_RED: LED 0402 RED SMD
D5 = LED_0402_BLUE: LED 0402 BLUE SMD
D6 = LED_0402_GREEN: LED 0402 GREEN SMD
F1 = CMP-07400-000010-1: PTC RESET FUSE 6V 500MA 0603; Manufacturer: Bourns Inc.; Trip Current: 1A; Current Rating: 40A; Hold Current: 0.5A; Resistance: 0.1-0.8Ω; Value: 0.1-0.8Ω; Trip Time: 0.1s; Mouser Description: Resettable Fuses - PPTC 6volts 40amps; Category: Fuse; Digikey Description: PTC RESET FUSE 6V 500MA 0603; Temperature: -40°C to +85°C; Device Class L3: unset; Automotive: No; RoHS: TRUE; Ambient Temperature Range High: +85°C; Device Class L2: PTC Resettable Fuses; Temperature Range High: +85°C; Voltage Rating: 6V; Package: MF-FSMF; Manufacturer Part Number: MF-FSMF050X-2; Ambient Temperature Range Low: -40°C; Lead Free: Yes; ComponentLink2Description: Datasheet; Octopart: https://octopart.com/mf-fsmf050x-2-bourns-10470804; ComponentLink2URL: https://www.bourns.com/docs/Product-Datasheets/mffsmf.pdf; Temperature Range Low: -40°C; Height: 1mm; Device Class L1: Circuit Protection
FB1 = FB_0603: Ferrite Bead SMD 0603; Manufacturer: *; Manufacturer Part Number: *; Distributor Link: *; LCSC: *
J1 = CMP-2000-05120-1: Micro USB B Type Receptacle, 1.8 A, -55 to 85 degC, 5-Pin SMD, RoHS, Tape and Reel; Manufacturer: Amphenol FCI; Body Orientation: RightAngle; Number of Contacts: 5; Pitch: 0.65mm; Gender: RCP; Rad Hard: No; Package Reference: 10118194-0001LF-5; Mounting: SurfaceMount; Manufacturer URL: http://www.fci.com/; Packaging: CutTape; Datasheet URL: https://datasheet.ciiva.com/26945/getdatasheetpartid-418619-26945695.pdf; Termination Method: Solder; Package Description: 5-Pin Surface Mount Device, Body 8.05 x 5.53 mm, Pitch 0.65 mm; Type: MicroUSBTypeB; Datasheet Version: Rev. A, 10/2011
J2 = CMP-2000-05162-1: Male Header, Pitch 2 mm, 1 x 2 Position, Height 6 mm, Tail Length 3.4 mm, -25 to 85 degC, RoHS, Bulk; Manufacturer: JST; Pitch: 2mm; Style/Orientation: StraightHeader/Plug; No of Positions: 2; Datasheet Version: Nov-08; Datasheet URL: http://datasheet.octopart.com/B2B-PH-K-S%28LF%29%28SN%29-JST-datasheet-8324864.pdf; Manufacturer URL: http://www.jst.com/home2.html; Type: ShroudedHeader; Termination: Crimp
J5-J9 = CMP-19636-000027-1: PC TEST POINT MINIATURE RED; Outside Diameter: 2.54mm; Body Material: Bronze; Number of Contacts: 1; Insulation: Insulated; Inside Diameter: 1.27mm; Hole Diameter: 1.6mm; Plating: Silver; Length: 7.62mm; Package Quantity: 100; Number of Ports: 1; Contact Material: Bronze; Orientation: Straight; RoHS Compliant: Yes; Housing Color: Red; Height: 0.3inch; Series: THM; Lead Free: Lead Free; Color: Red; Contact Plating: Tin; Mount: PCB; Packaging: Bulk; REACH SVHC: No SVHC; Flammability Rating: UL94 V-0; Material: Nylon
R6-R13 R17 = RES_0402: Resistor SMD 0402; Manufacturer: *; Manufacturer Part Number: *; Distributor Link: *; LCSC: *
U2 = CMP-0133-00007-1: Stand-Alone System Load Sharing and Li-Ion/Li-Polymer Battery Charge Management Controller, 4.35V, 20-Pin QFN, Industrial Temperature; PackageReference: QFN-ML20; PackageDescription: 20-Lead Plastic Quad Flat, No Lead Package (ML) - 4x4x0.9 mm Body [QFN]; PackageVersion: revBB, Aug-2009; DatasheetVersion: revB, May-2009

## Nets that join several sheets
+3.3V: STM32RF_MCU (9 pins), STM32RF_NRF (6 pins), STM32RF_BME280 (9 pins), STM32RF_PowerUSBSchDoc (B1.2 C14.1 D7.A J6.1)
GND: STM32RF_MCU (19 pins), STM32RF_NRF (17 pins), STM32RF_BME280 (5 pins), STM32RF_PowerUSBSchDoc (21 pins)
I2C1_SCL: STM32RF_MCU (U1.19), STM32RF_BME280 (J4.3 R14.1 U4.4)
I2C1_SDA: STM32RF_MCU (U1.20), STM32RF_BME280 (J4.4 R15.1 U4.3)
NRF_CE: STM32RF_MCU (U1.30), STM32RF_NRF (U3.1)
NRF_IRQ: STM32RF_MCU (U1.25), STM32RF_NRF (U3.6)
NRF_SPI3_ICS: STM32RF_MCU (U1.29), STM32RF_NRF (U3.2)
SPI3_MISO: STM32RF_MCU (U1.27), STM32RF_NRF (U3.5)
SPI3_MOSI: STM32RF_MCU (U1.28), STM32RF_NRF (U3.4)
SPI3_SCK: STM32RF_MCU (U1.26), STM32RF_NRF (U3.3)
USB_D_N: STM32RF_MCU (U1.21), STM32RF_PowerUSBSchDoc (D3.6)
USB_D_P: STM32RF_MCU (U1.22), STM32RF_PowerUSBSchDoc (D3.4)